# Altium schematic sheet РЕУН.468323.001_Interface.SchDoc: =Name-1str
size 840 x 594 mm; SheetNumber: 3; Вид изделия: Документация; Раздел: Документация; Код документа: Э3; Вид документа: Схема электрическая принципиальная; Класс документа: Конструкторский документ; Создавать изделие в PLM: Yes; DocumentCode: РЕУН.468323.001 Э3 2D; DocumentView: Схема электрическая принципиальная; DocumentClass: Конструкторский документ; ProductView: Документация; Format: А1
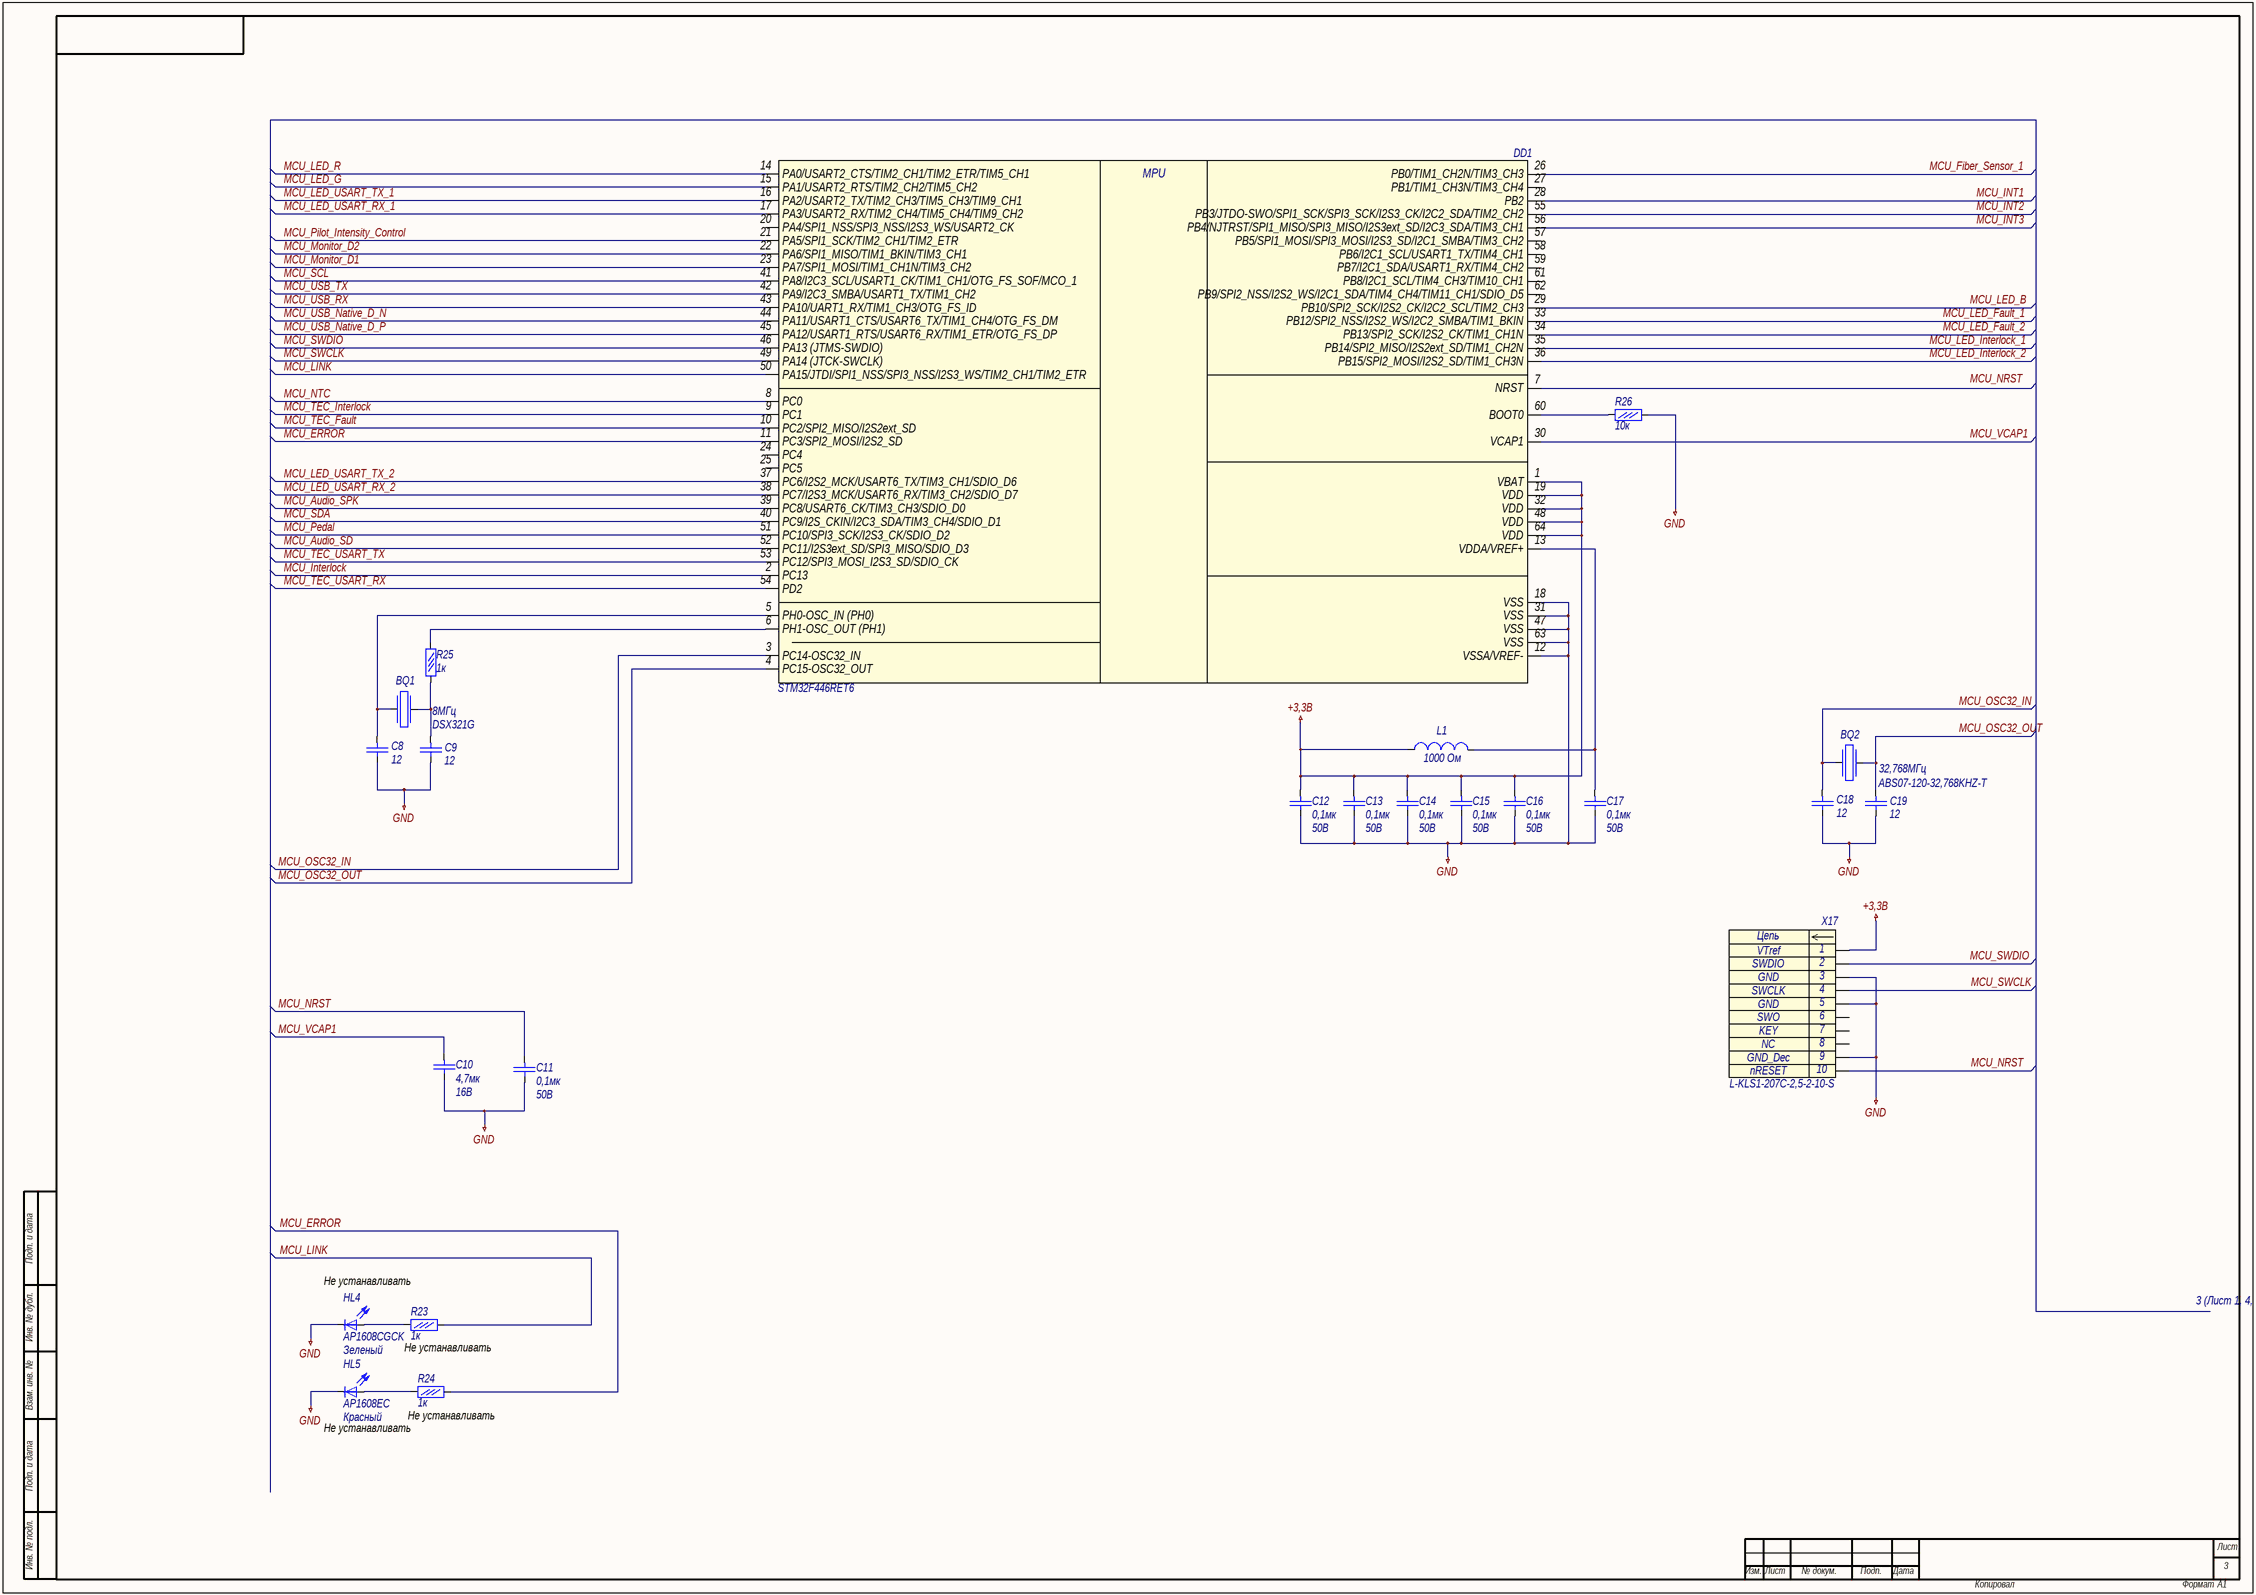
[diagram p0: РЕУН.468323.001_Interface.SchDoc]

## Parts
BQ1  Name: DSX321G  [QSMD3.2x2.5_A]  (hidden comment: 8МГц)
BQ2  Name: ABS07-120-32,768KHZ-T  [QSMD3.2x2.5_A]  (hidden comment: 32,768МГц)
C8  12  [C0805_AA]
C9  12  [C0805_AA]
C10  Voltage: 16В  [C0805_AA]  (hidden comment: 4,7мк)
C11  Voltage: 50В  [C0805_AA]  (hidden comment: 0,1мк)
C12  Voltage: 50В  [C0805_AA]  (hidden comment: 0,1мк)
C13  Voltage: 50В  [C0805_AA]  (hidden comment: 0,1мк)
C14  Voltage: 50В  [C0805_AA]  (hidden comment: 0,1мк)
C15  Voltage: 50В  [C0805_AA]  (hidden comment: 0,1мк)
C16  Voltage: 50В  [C0805_AA]  (hidden comment: 0,1мк)
C17  Voltage: 50В  [C0805_AA]  (hidden comment: 0,1мк)
C18  12  [C0805_AA]
C19  12  [C0805_AA]
DD1  STM32F446RET6
HL4  Color: Зеленый  (hidden comment: AP1608CGCK)
HL5  Color: Красный  (hidden comment: AP1608EC)
L1  1000 Ом  [L0603_A]
R23  1к  [R1206]
R24  1к  [R1206]
R25  1к  [R1206]
R26  10к  [R1206]
X17  L-KLS1-207C-2,5-2-10-S

## Nets
+3,3В: C12.2 C13.2 C14.2 C15.2 C16.2 DD1.1(VBAT) DD1.19(VDD) DD1.32(VDD) DD1.48(VDD) DD1.64(VDD) L1.1 X17.1
GND: C8.1 C9.1 C10.1 C11.1 C12.1 C13.1 C14.1 C15.1 C16.1 C17.1 C18.1 C19.1 DD1.12(VSSA/VREF-) DD1.18(VSS) DD1.31(VSS) DD1.47(VSS) DD1.63(VSS) HL4.2(K) HL5.2(K) R26.1 X17.3 X17.5 X17.9
MCU_Audio_SD: DD1.52(PC11/I2S3ext_SD/SPI3_MISO/SDIO_D3)
MCU_Audio_SPK: DD1.39(PC8/USART6_CK/TIM3_CH3/SDIO_D0)
MCU_ERROR: DD1.11(PC3/SPI2_MOSI/I2S2_SD) R24.1
MCU_Fiber_Sensor_1: DD1.26(PB0/TIM1_CH2N/TIM3_CH3)
MCU_INT1: DD1.28(PB2)
MCU_INT2: DD1.55(PB3/JTDO-SWO/SPI1_SCK/SPI3_SCK/I2S3_CK/I2C2_SDA/TIM2_CH2)
MCU_INT3: DD1.56(PB4/NJTRST/SPI1_MISO/SPI3_MISO/I2S3ext_SD/I2C3_SDA/TIM3_CH1)
MCU_Interlock: DD1.2(PC13)
MCU_LED_B: DD1.29(PB10/SPI2_SCK/I2S2_CK/I2C2_SCL/TIM2_CH3)
MCU_LED_Fault_1: DD1.33(PB12/SPI2_NSS/I2S2_WS/I2C2_SMBA/TIM1_BKIN)
MCU_LED_Fault_2: DD1.34(PB13/SPI2_SCK/I2S2_CK/TIM1_CH1N)
MCU_LED_G: DD1.15(PA1/USART2_RTS/TIM2_CH2/TIM5_CH2)
MCU_LED_Interlock_1: DD1.35(PB14/SPI2_MISO/I2S2ext_SD/TIM1_CH2N)
MCU_LED_Interlock_2: DD1.36(PB15/SPI2_MOSI/I2S2_SD/TIM1_CH3N)
MCU_LED_R: DD1.14(PA0/USART2_CTS/TIM2_CH1/TIM2_ETR/TIM5_CH1)
MCU_LED_USART_RX_1: DD1.17(PA3/USART2_RX/TIM2_CH4/TIM5_CH4/TIM9_CH2)
MCU_LED_USART_RX_2: DD1.38(PC7/I2S3_MCK/USART6_RX/TIM3_CH2/SDIO_D7)
MCU_LED_USART_TX_1: DD1.16(PA2/USART2_TX/TIM2_CH3/TIM5_CH3/TIM9_CH1)
MCU_LED_USART_TX_2: DD1.37(PC6/I2S2_MCK/USART6_TX/TIM3_CH1/SDIO_D6)
MCU_LINK: DD1.50(PA15/JTDI/SPI1_NSS/SPI3_NSS/I2S3_WS/TIM2_CH1/TIM2_ETR) R23.1
MCU_Monitor_D1: DD1.23(PA7/SPI1_MOSI/TIM1_CH1N/TIM3_CH2)
MCU_Monitor_D2: DD1.22(PA6/SPI1_MISO/TIM1_BKIN/TIM3_CH1)
MCU_NRST: C11.2 X17.10
MCU_NTC: DD1.8(PC0)
MCU_OSC32_IN: BQ2.2 C18.2 DD1.3(PC14-OSC32_IN)
MCU_OSC32_OUT: BQ2.1 C19.2 DD1.4(PC15-OSC32_OUT)
MCU_Pedal: DD1.51(PC10/SPI3_SCK/I2S3_CK/SDIO_D2)
MCU_Pilot_Intensity_Control: DD1.21(PA5/SPI1_SCK/TIM2_CH1/TIM2_ETR)
MCU_SCL: DD1.41(PA8/I2C3_SCL/USART1_CK/TIM1_CH1/OTG_FS_SOF/MCO_1)
MCU_SDA: DD1.40(PC9/I2S_CKIN/I2C3_SDA/TIM3_CH4/SDIO_D1)
MCU_SWCLK: DD1.49(PA14_(JTCK-SWCLK)) X17.4
MCU_SWDIO: DD1.46(PA13_(JTMS-SWDIO)) X17.2
MCU_TEC_Fault: DD1.10(PC2/SPI2_MISO/I2S2ext_SD)
MCU_TEC_Interlock: DD1.9(PC1)
MCU_TEC_USART_RX: DD1.54(PD2)
MCU_TEC_USART_TX: DD1.53(PC12/SPI3_MOSI_I2S3_SD/SDIO_CK)
MCU_USB_Native_D_N: DD1.44(PA11/USART1_CTS/USART6_TX/TIM1_CH4/OTG_FS_DM)
MCU_USB_Native_D_P: DD1.45(PA12/USART1_RTS/USART6_RX/TIM1_ETR/OTG_FS_DP)
MCU_USB_RX: DD1.43(PA10/UART1_RX/TIM1_CH3/OTG_FS_ID)
MCU_USB_TX: DD1.42(PA9/I2C3_SMBA/USART1_TX/TIM1_CH2)
MCU_VCAP1: C10.2 DD1.30(VCAP1)
NetBQ1_1: BQ1.1 C8.2 DD1.5(PH0-OSC_IN_(PH0))
NetBQ1_2: BQ1.2 C9.2 R25.1
NetC17_2: C17.2 DD1.13(VDDA/VREF+) L1.2
NetDD1_6: DD1.6(PH1-OSC_OUT_(PH1)) R25.2
NetDD1_60: DD1.60(BOOT0) R26.2
NetHL4_1: HL4.1(A) R23.2
NetHL5_1: HL5.1(A) R24.2

Not connected (* = marked no-connect by the designer): DD1 7(NRST) 20(PA4/SPI1_NSS/SPI3_NSS/I2S3_WS/USART2_CK) 24(PC4) 25(PC5) 27(PB1/TIM1_CH3N/TIM3_CH4) 57(PB5/SPI1_MOSI/SPI3_MOSI/I2S3_SD/I2C1_SMBA/TIM3_CH2) 58(PB6/I2C1_SCL/USART1_TX/TIM4_CH1) 59(PB7/I2C1_SDA/USART1_RX/TIM4_CH2) 61(PB8/I2C1_SCL/TIM4_CH3/TIM10_CH1) 62(PB9/SPI2_NSS/I2S2_WS/I2C1_SDA/TIM4_CH4/TIM11_CH1/SDIO_D5); X17 6 7 8

## Notes on the sheet
- Не устанавливать
- 3 (Лист 1, 4, 5, 6, 7, 8, 9, 10, 11, 12)
- (near R23) Не устанавливать
- (near R24) Не устанавливать
- Labels drawn without touching a wire or pin: MCU_NRST
- Подп. и дата
- Инв. № дубл.
- Взам. инв. №
- Инв. № подл.
- Лист
- Изм.
- № докум.
- Подп.
- Дата
- Копировал
- Формат
- (in symbol STM32F401RET6) MPU
- (in symbol x10-m) Цепь

## Library data of the parts
BQ1 BQ2 = Crystal: Кварцевый резонатор
  BQ1: Value: 8МГц
  BQ2: Value: 32,768МГц
C8-C19 = Конденсатор кер.
  C8 C9 C18 C19: Value: 12
  C10: Value: 4,7мк
  C11-C17: Value: 0,1мк
DD1 = STM32F401RET6: 32-битный микроконтроллер
HL4 HL5 = led: Светодиод
  HL4: Name: AP1608CGCK
  HL5: Name: AP1608EC
L1 = Inductor: Катушка индуктивности; Value: 1000 Ом
R23-R26 = Резистор  0,05Вт: Резистор 0,05Вт; Power rating: 0,05Вт
  R23-R25: Value: 1к
  R26: Value: 10к
X17 = x10-m: Разъем - 10 конт. вилка; Contact_1: VTref; Contact_2: SWDIO; Contact_3: GND; Contact_4: SWCLK; Contact_6: SWO; Contact_7: KEY; Contact_8: NC; Contact_9: GND_Dec; Contact_10: nRESET; Contact_5: GND; Name: L-KLS1-207C-2,5-2-10-S